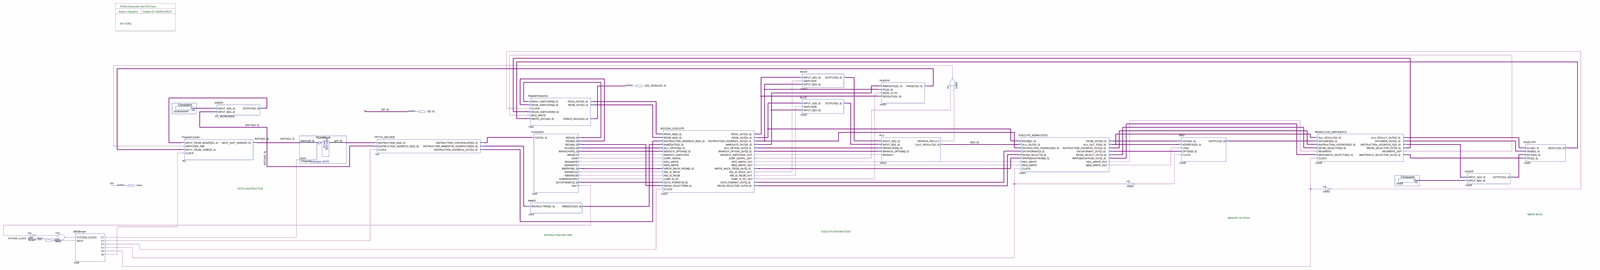
[diagram p0: schematic sheet, whole]
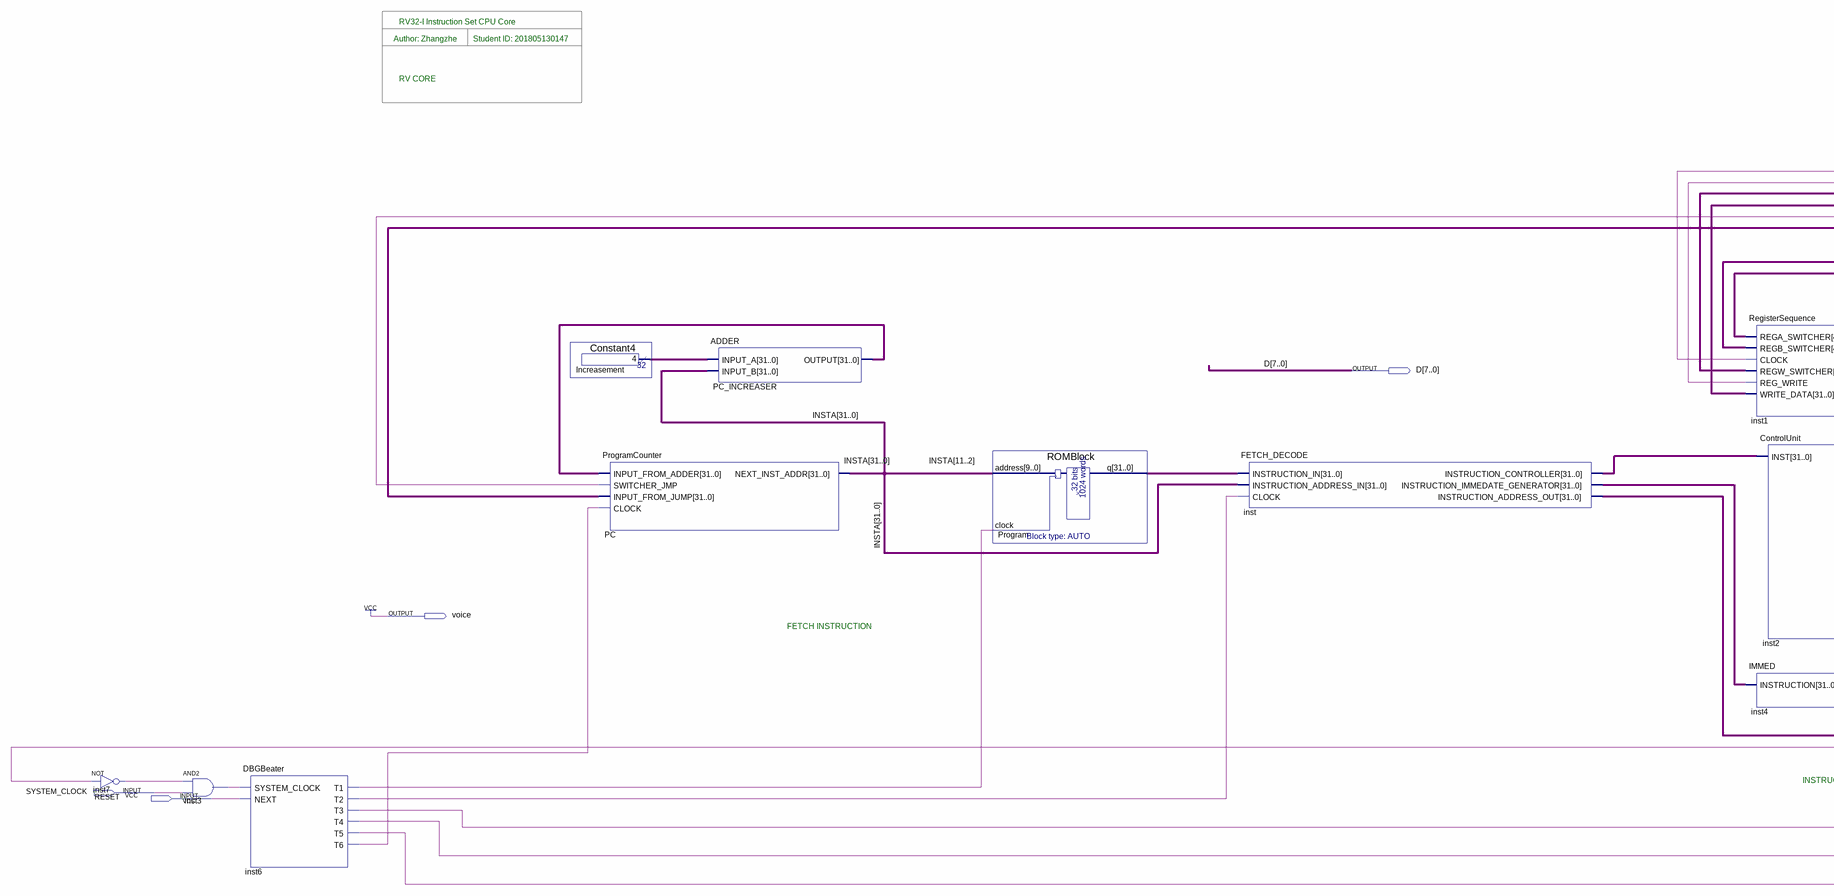
[diagram p1: schematic sheet, left part]
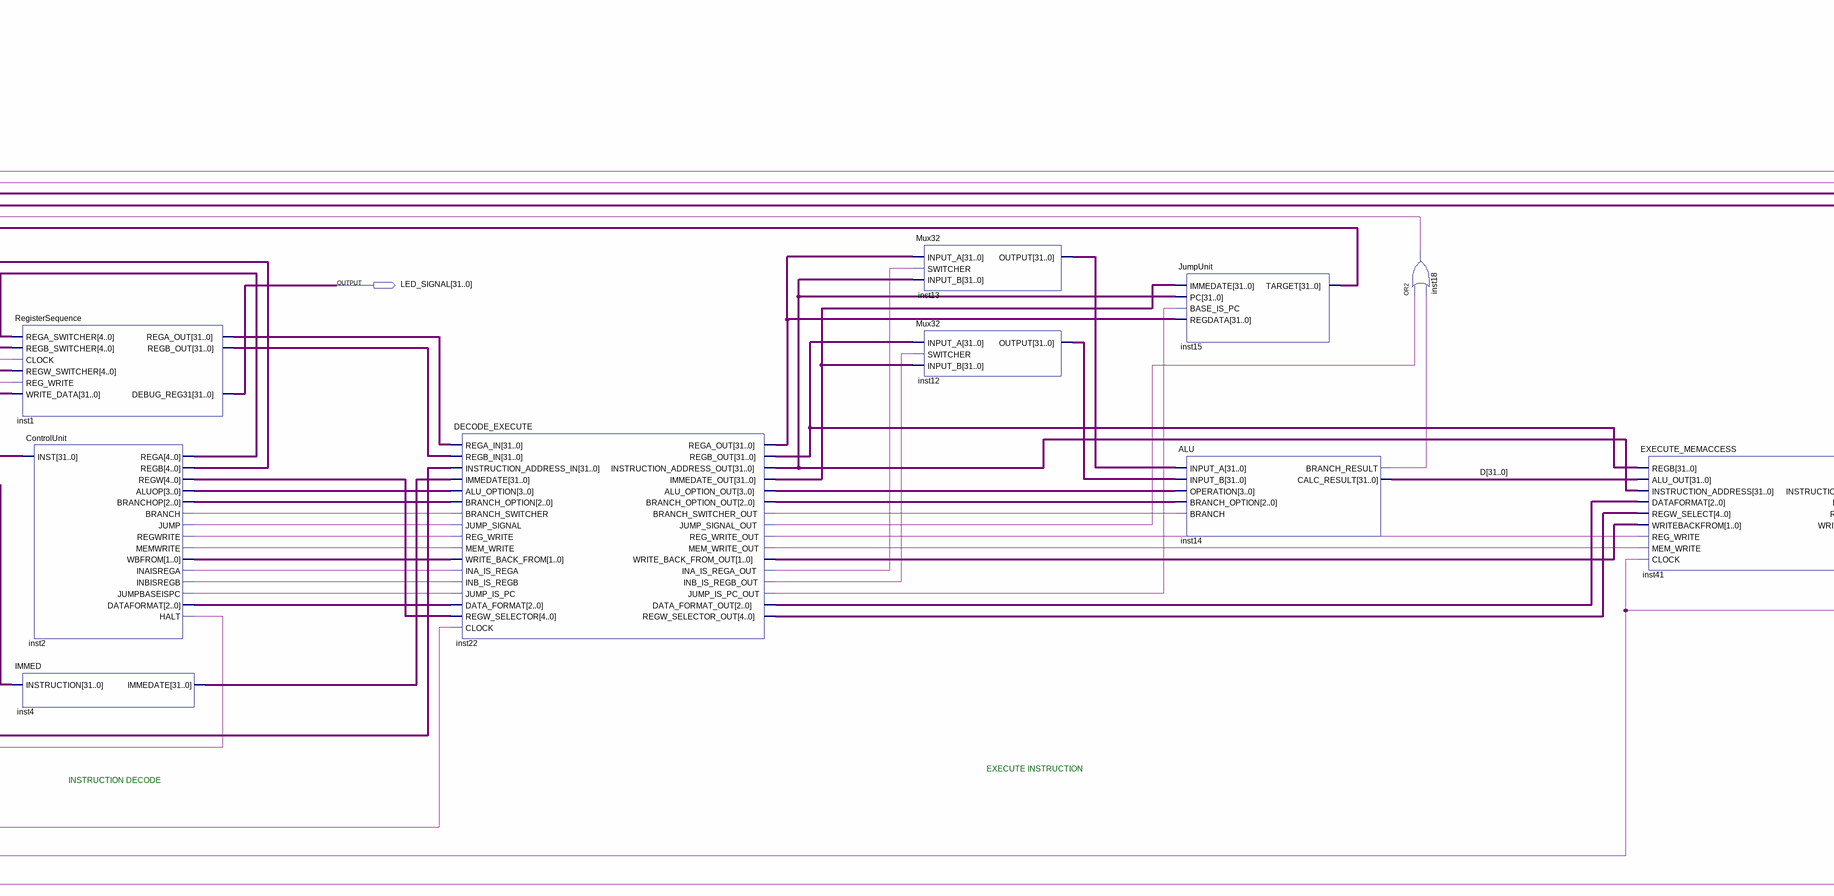
[diagram p2: schematic sheet, centre part]
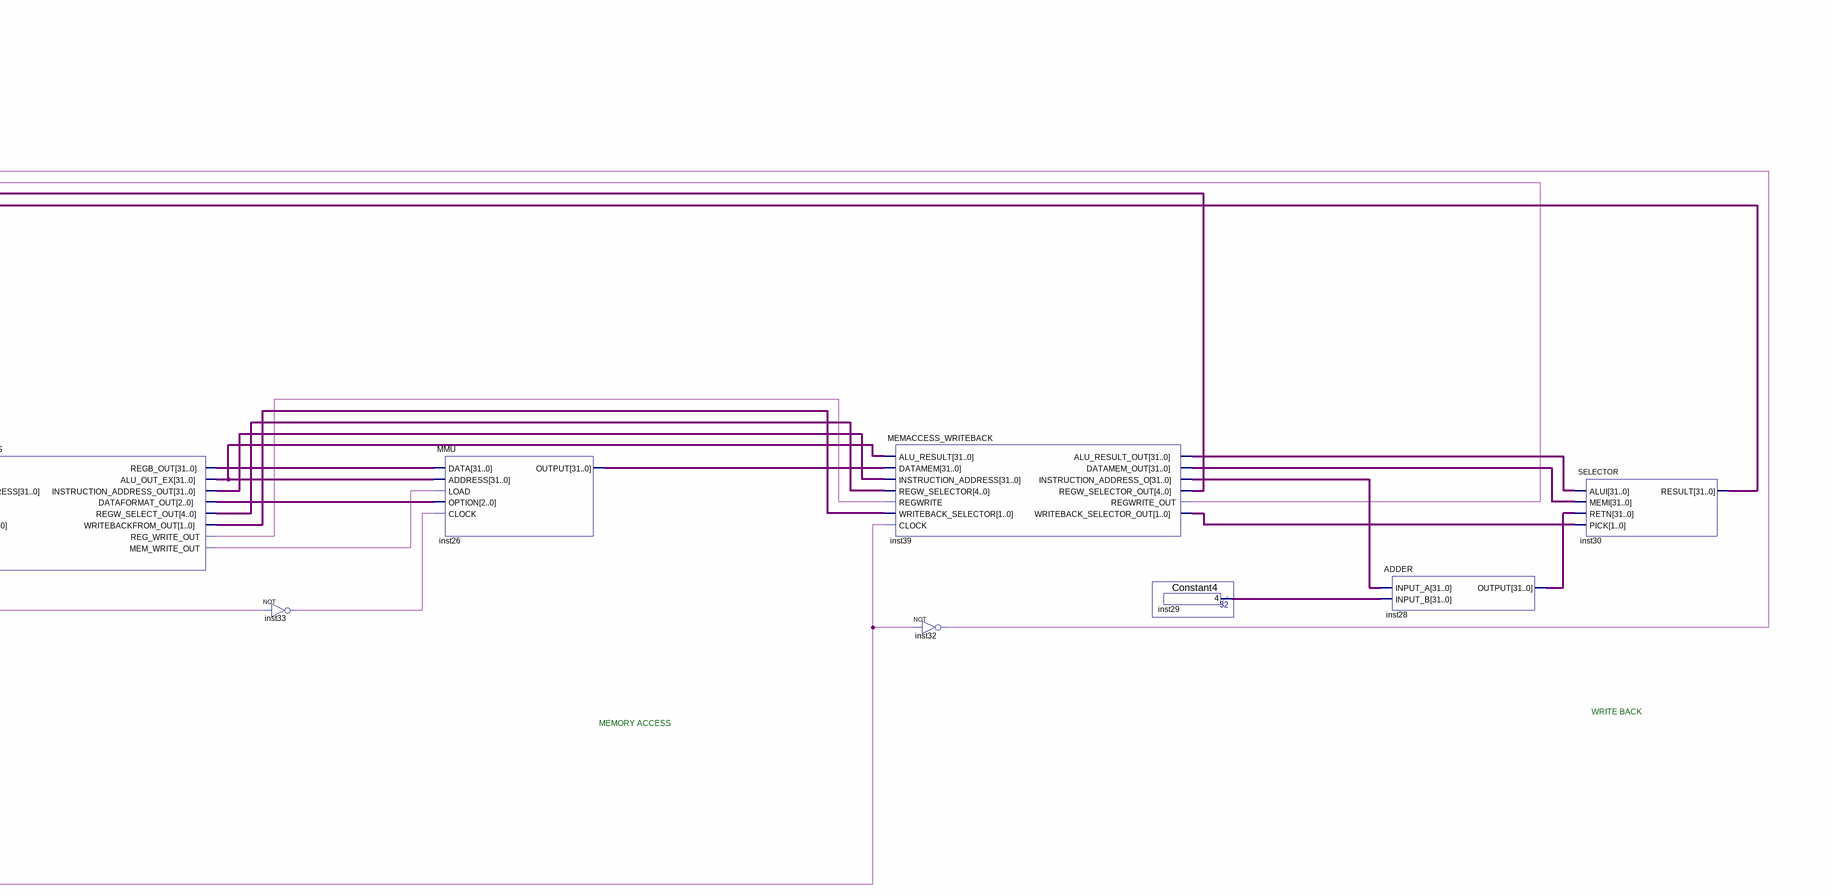
[diagram p3: schematic sheet, right part]
// Quartus schematic RVCore.bdf as structural Verilog: 25 symbols, 5 pins
module RVCore (
  input  SYSTEM_CLOCK,
  input  RESET,
  output [31:0] LED_SIGNAL,
  output [31:0] D,
  output voice
);

  wire inst2_branch, inst2_halt, inst2_inaisrega, inst2_inbisregb, inst2_jump, inst2_jumpbaseispc,
       inst2_memwrite, inst2_regwrite, inst3_out, inst6_t1, inst6_t2, inst6_t3, inst6_t4, inst6_t5, inst6_t6,
       inst7_out, inst14_branch_result, inst18_out, inst22_branch_switcher_out, inst22_ina_is_rega_out,
       inst22_inb_is_regb_out, inst22_jump_is_pc_out, inst22_jump_signal_out, inst22_mem_write_out,
       inst22_reg_write_out, inst32_out, inst33_out, inst39_regwrite_out, inst41_mem_write_out,
       inst41_reg_write_out;
  wire [1:0] inst2_wbfrom, inst22_write_back_from_out, inst39_writeback_selector_out,
       inst41_writebackfrom_out;
  wire [2:0] inst2_branchop, inst2_dataformat, inst22_branch_option_out, inst22_data_format_out,
       inst41_dataformat_out;
  wire [3:0] inst2_aluop, inst22_alu_option_out;
  wire [4:0] inst2_rega, inst2_regb, inst2_regw, inst22_regw_selector_out, inst39_regw_selector_out,
       inst41_regw_select_out;
  wire [31:0] Increasement_result, inst1_rega_out, inst1_regb_out, inst4_immedate, inst12_output,
       inst13_output, inst15_target, inst22_immedate_out, inst22_instruction_address_out, inst22_rega_out,
       inst22_regb_out, inst26_output, inst28_output, inst29_result, inst30_result, inst39_alu_result_out,
       inst39_datamem_out, inst39_instruction_address_o, inst41_alu_out_ex, inst41_instruction_address_out,
       inst41_regb_out, inst_instruction_address_out, inst_instruction_controller,
       inst_instruction_immedate_generator, INSTA, PC_INCREASER_output, Program_q;

  not inst7 (inst7_out, inst2_halt);
  and inst3 (inst3_out, inst7_out, SYSTEM_CLOCK);
  DBGBeater inst6 (
    .SYSTEM_CLOCK(inst3_out), .NEXT(RESET), .T6(inst6_t6), .T5(inst6_t5), .T4(inst6_t4), .T3(inst6_t3),
    .T2(inst6_t2), .T1(inst6_t1));
  Constant4 Increasement (.result(Increasement_result));
  ProgramCounter PC (
    .INPUT_FROM_JUMP(inst15_target), .SWITCHER_JMP(inst18_out), .INPUT_FROM_ADDER(PC_INCREASER_output),
    .CLOCK(inst6_t6), .NEXT_INST_ADDR(INSTA));
  ADDER PC_INCREASER (.INPUT_A(Increasement_result), .INPUT_B(INSTA), .OUTPUT(PC_INCREASER_output));
  ROMBlock Program (.address(INSTA[11:2]), .clock(inst6_t1), .q(Program_q));
  FETCH_DECODE inst (
    .INSTRUCTION_IN(Program_q), .INSTRUCTION_ADDRESS_IN(INSTA), .CLOCK(inst6_t2),
    .INSTRUCTION_CONTROLLER(inst_instruction_controller),
    .INSTRUCTION_IMMEDATE_GENERATOR(inst_instruction_immedate_generator),
    .INSTRUCTION_ADDRESS_OUT(inst_instruction_address_out));
  RegisterSequence inst1 (
    .REGA_SWITCHER(inst2_rega), .REGB_SWITCHER(inst2_regb), .CLOCK(inst32_out),
    .REGW_SWITCHER(inst39_regw_selector_out), .REG_WRITE(inst39_regwrite_out), .WRITE_DATA(inst30_result),
    .REGB_OUT(inst1_regb_out), .REGA_OUT(inst1_rega_out), .DEBUG_REG31(LED_SIGNAL));
  ControlUnit inst2 (
    .INST(inst_instruction_controller), .REGA(inst2_rega), .REGB(inst2_regb), .REGW(inst2_regw),
    .ALUOP(inst2_aluop), .BRANCHOP(inst2_branchop), .BRANCH(inst2_branch), .JUMP(inst2_jump),
    .REGWRITE(inst2_regwrite), .MEMWRITE(inst2_memwrite), .WBFROM(inst2_wbfrom), .INAISREGA(inst2_inaisrega),
    .INBISREGB(inst2_inbisregb), .JUMPBASEISPC(inst2_jumpbaseispc), .DATAFORMAT(inst2_dataformat),
    .HALT(inst2_halt));
  IMMED inst4 (.INSTRUCTION(inst_instruction_immedate_generator), .IMMEDATE(inst4_immedate));
  DECODE_EXECUTE inst22 (
    .REGA_IN(inst1_rega_out), .REGB_IN(inst1_regb_out),
    .INSTRUCTION_ADDRESS_IN(inst_instruction_address_out), .IMMEDATE(inst4_immedate),
    .ALU_OPTION(inst2_aluop), .BRANCH_OPTION(inst2_branchop), .BRANCH_SWITCHER(inst2_branch),
    .JUMP_SIGNAL(inst2_jump), .REG_WRITE(inst2_regwrite), .MEM_WRITE(inst2_memwrite),
    .WRITE_BACK_FROM(inst2_wbfrom), .INA_IS_REGA(inst2_inaisrega), .INB_IS_REGB(inst2_inbisregb),
    .JUMP_IS_PC(inst2_jumpbaseispc), .DATA_FORMAT(inst2_dataformat), .REGW_SELECTOR(inst2_regw),
    .CLOCK(inst6_t3), .REGA_OUT(inst22_rega_out), .REGB_OUT(inst22_regb_out),
    .INSTRUCTION_ADDRESS_OUT(inst22_instruction_address_out), .IMMEDATE_OUT(inst22_immedate_out),
    .ALU_OPTION_OUT(inst22_alu_option_out), .BRANCH_OPTION_OUT(inst22_branch_option_out),
    .BRANCH_SWITCHER_OUT(inst22_branch_switcher_out), .JUMP_SIGNAL_OUT(inst22_jump_signal_out),
    .REG_WRITE_OUT(inst22_reg_write_out), .MEM_WRITE_OUT(inst22_mem_write_out),
    .WRITE_BACK_FROM_OUT(inst22_write_back_from_out), .INA_IS_REGA_OUT(inst22_ina_is_rega_out),
    .INB_IS_REGB_OUT(inst22_inb_is_regb_out), .JUMP_IS_PC_OUT(inst22_jump_is_pc_out),
    .DATA_FORMAT_OUT(inst22_data_format_out), .REGW_SELECTOR_OUT(inst22_regw_selector_out));
  Mux32 inst13 (
    .INPUT_A(inst22_rega_out), .SWITCHER(inst22_ina_is_rega_out), .INPUT_B(inst22_instruction_address_out),
    .OUTPUT(inst13_output));
  Mux32 inst12 (
    .INPUT_A(inst22_regb_out), .SWITCHER(inst22_inb_is_regb_out), .INPUT_B(inst22_immedate_out),
    .OUTPUT(inst12_output));
  JumpUnit inst15 (
    .IMMEDATE(inst22_immedate_out), .PC(inst22_instruction_address_out), .BASE_IS_PC(inst22_jump_is_pc_out),
    .REGDATA(inst22_rega_out), .TARGET(inst15_target));
  ALU inst14 (
    .INPUT_A(inst13_output), .INPUT_B(inst12_output), .OPERATION(inst22_alu_option_out),
    .BRANCH_OPTION(inst22_branch_option_out), .BRANCH(inst22_branch_switcher_out),
    .BRANCH_RESULT(inst14_branch_result), .CALC_RESULT(D));
  or inst18 (inst18_out, inst22_jump_signal_out, inst14_branch_result);
  EXECUTE_MEMACCESS inst41 (
    .REGB(inst22_regb_out), .ALU_OUT(D), .INSTRUCTION_ADDRESS(inst22_instruction_address_out),
    .DATAFORMAT(inst22_data_format_out), .REGW_SELECT(inst22_regw_selector_out),
    .WRITEBACKFROM(inst22_write_back_from_out), .REG_WRITE(inst22_reg_write_out),
    .MEM_WRITE(inst22_mem_write_out), .CLOCK(inst6_t4), .REGB_OUT(inst41_regb_out),
    .ALU_OUT_EX(inst41_alu_out_ex), .INSTRUCTION_ADDRESS_OUT(inst41_instruction_address_out),
    .DATAFORMAT_OUT(inst41_dataformat_out), .REGW_SELECT_OUT(inst41_regw_select_out),
    .WRITEBACKFROM_OUT(inst41_writebackfrom_out), .REG_WRITE_OUT(inst41_reg_write_out),
    .MEM_WRITE_OUT(inst41_mem_write_out));
  not inst33 (inst33_out, inst6_t4);
  MMU inst26 (
    .DATA(inst41_regb_out), .ADDRESS(inst41_alu_out_ex), .LOAD(inst41_mem_write_out),
    .OPTION(inst41_dataformat_out), .CLOCK(inst33_out), .OUTPUT(inst26_output));
  MEMACCESS_WRITEBACK inst39 (
    .ALU_RESULT(inst41_alu_out_ex), .DATAMEM(inst26_output),
    .INSTRUCTION_ADDRESS(inst41_instruction_address_out), .REGW_SELECTOR(inst41_regw_select_out),
    .REGWRITE(inst41_reg_write_out), .WRITEBACK_SELECTOR(inst41_writebackfrom_out), .CLOCK(inst6_t5),
    .ALU_RESULT_OUT(inst39_alu_result_out), .DATAMEM_OUT(inst39_datamem_out),
    .INSTRUCTION_ADDRESS_O(inst39_instruction_address_o), .REGW_SELECTOR_OUT(inst39_regw_selector_out),
    .REGWRITE_OUT(inst39_regwrite_out), .WRITEBACK_SELECTOR_OUT(inst39_writeback_selector_out));
  not inst32 (inst32_out, inst6_t5);
  Constant4 inst29 (.result(inst29_result));
  ADDER inst28 (.INPUT_A(inst39_instruction_address_o), .INPUT_B(inst29_result), .OUTPUT(inst28_output));
  SELECTOR inst30 (
    .ALUI(inst39_alu_result_out), .MEMI(inst39_datamem_out), .RETN(inst28_output),
    .PICK(inst39_writeback_selector_out), .RESULT(inst30_result));

  assign voice = 1'b1;

  // Notes on the sheet:
  //   RV32-I Instruction Set CPU Core
  //   Author: Zhangzhe        Student ID: 201805130147
  //   RV CORE
  //   FETCH INSTRUCTION
  //   WRITE BACK
  //   MEMORY ACCESS
  //   EXECUTE INSTRUCTION
  //   INSTRUCTION DECODE
endmodule
